# EAGLE schematic FLIC V2 (EAGLE 6.5.0)
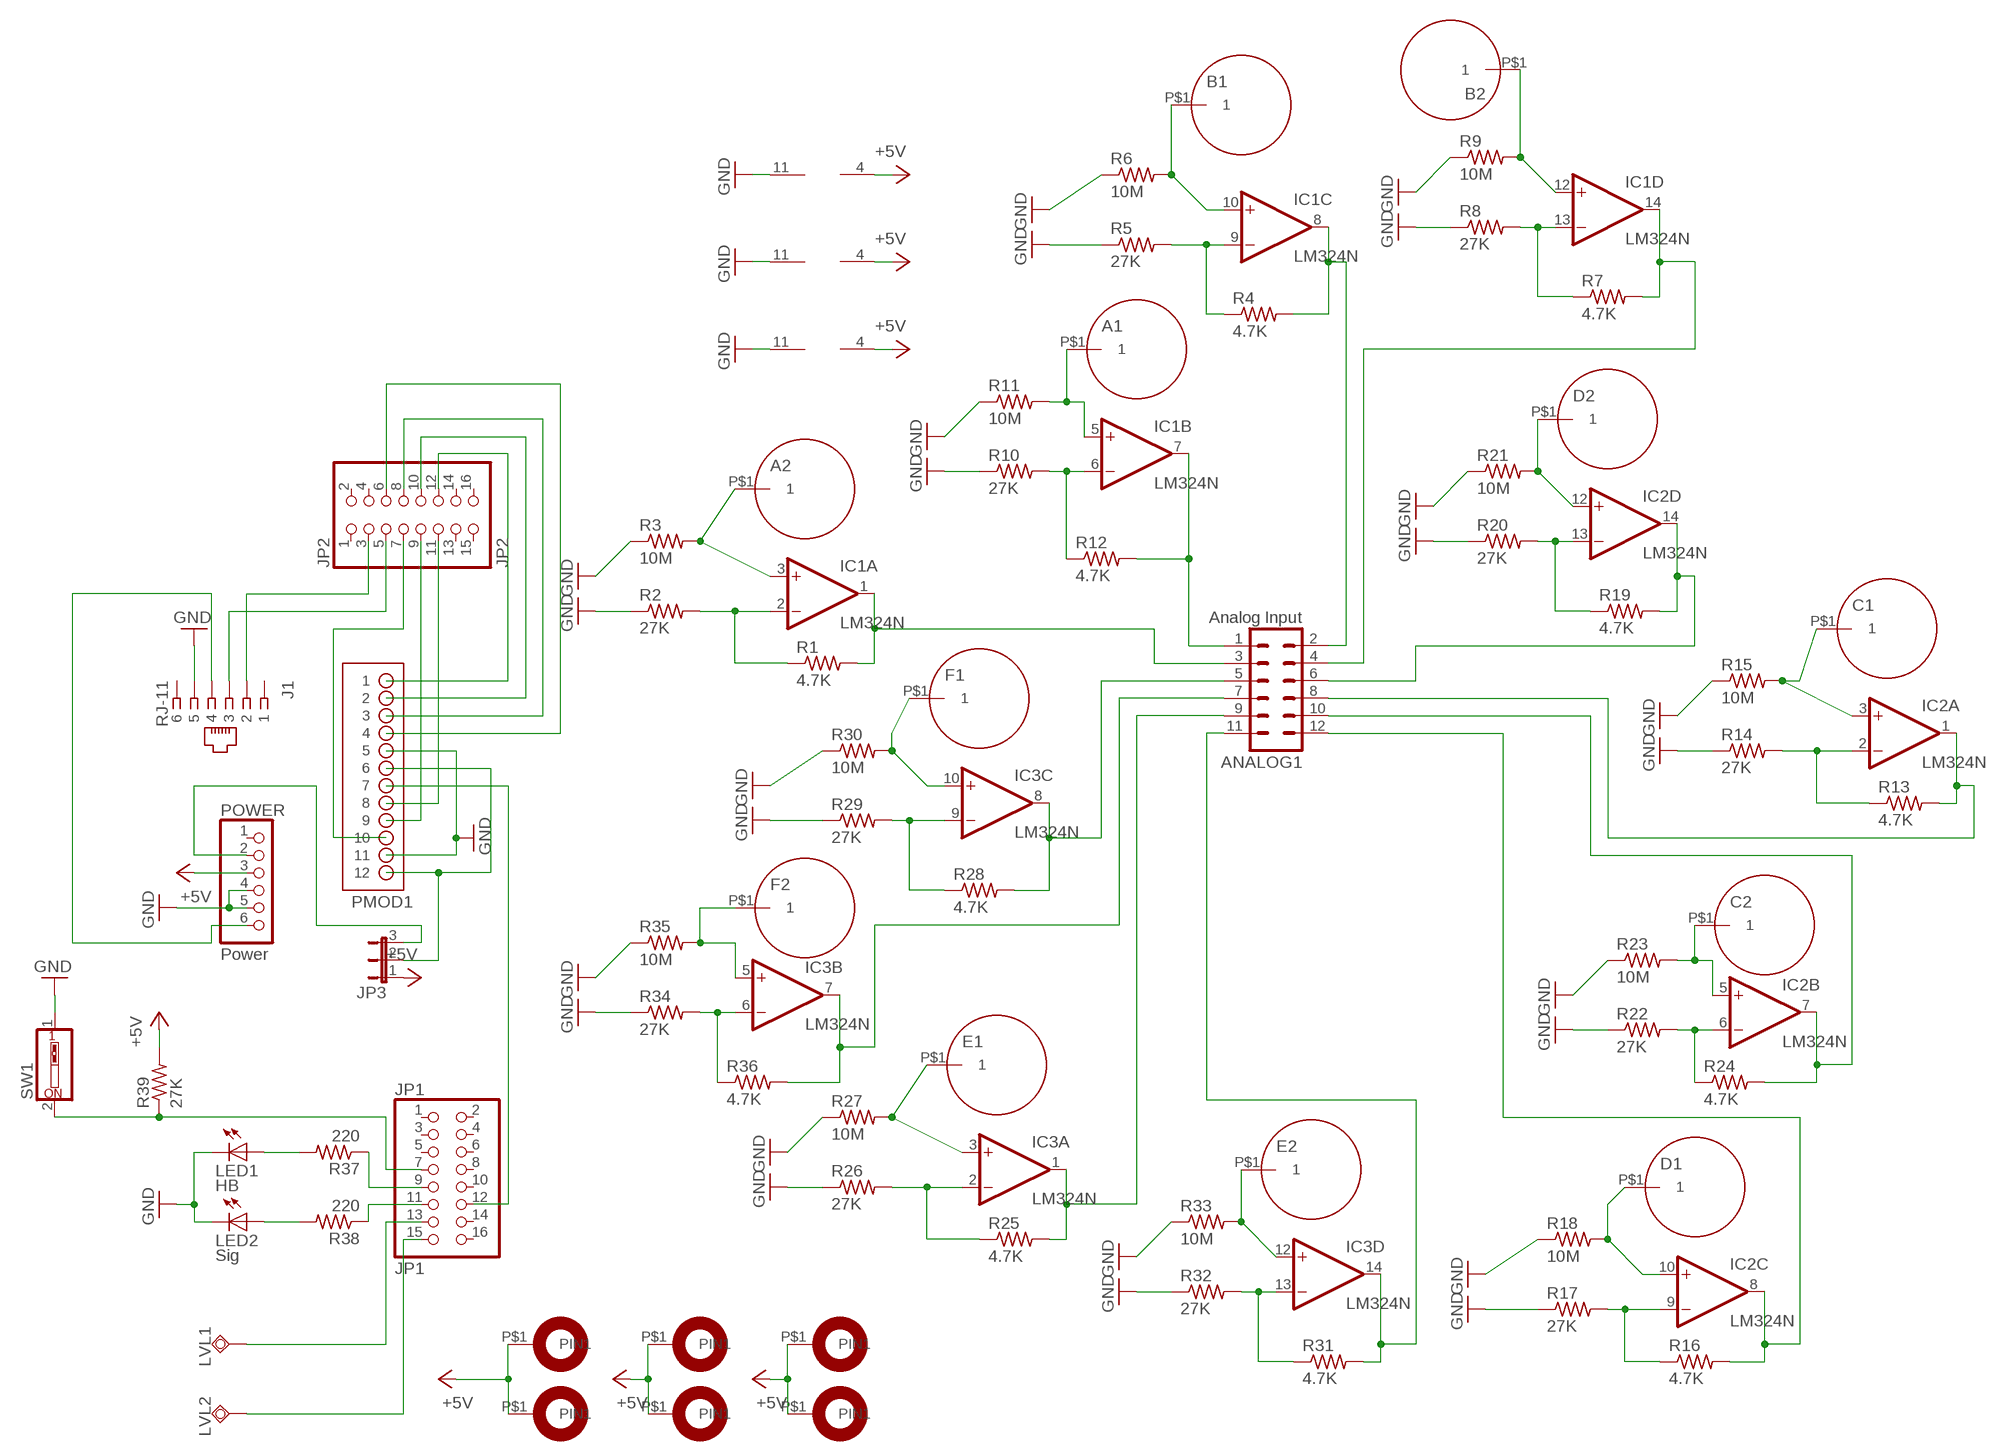
[diagram p0: schematic, sheet 1]

## Parts
A1  FLIC_PADPAD  [FLICPAD]
A2  FLIC_PADPAD  [FLICPAD]
ANALOG1  Analog Input  MA06-2  [MA06-2]
B1  FLIC_PADPAD  [FLICPAD]
B2  FLIC_PADPAD  [FLICPAD]
C1  FLIC_PADPAD  [FLICPAD]
C2  FLIC_PADPAD  [FLICPAD]
D1  FLIC_PADPAD  [FLICPAD]
D2  FLIC_PADPAD  [FLICPAD]
E1  FLIC_PADPAD  [FLICPAD]
E2  FLIC_PADPAD  [FLICPAD]
F1  FLIC_PADPAD  [FLICPAD]
F2  FLIC_PADPAD  [FLICPAD]
IC1  LM324N  [DIL14]
IC2  LM324N  [DIL14]
IC3  LM324N  [DIL14]
J1  RJ-11  RJ11-2L-B  [RJ11-NO_SHIELD]
JP1  JP1  PINHD-2X8  [2X08]
JP2  JP2  PINHD-2X8  [2X08]
JP3  JP2E  [JP2]
LED1  HB  LED3MM  [LED3MM]
LED2  Sig  LED3MM  [LED3MM]
LVL1  TPSQTP20R  [TP20R]
LVL2  TPSQTP20R  [TP20R]
PMOD1  PMOD-2X6-S  [PMOD-2X6-S]
POWER  Power  PINHD-1X6  [1X06]
R1  4.7K  R-US_0207/10  [0207/10]
R2  27K  R-US_0207/10  [0207/10]
R3  10M  R-US_0207/10  [0207/10]
R4  4.7K  R-US_0207/10  [0207/10]
R5  27K  R-US_0207/10  [0207/10]
R6  10M  R-US_0207/10  [0207/10]
R7  4.7K  R-US_0207/10  [0207/10]
R8  27K  R-US_0207/10  [0207/10]
R9  10M  R-US_0207/10  [0207/10]
R10  27K  R-US_0207/10  [0207/10]
R11  10M  R-US_0207/10  [0207/10]
R12  4.7K  R-US_0207/10  [0207/10]
R13  4.7K  R-US_0207/10  [0207/10]
R14  27K  R-US_0207/10  [0207/10]
R15  10M  R-US_0207/10  [0207/10]
R16  4.7K  R-US_0207/10  [0207/10]
R17  27K  R-US_0207/10  [0207/10]
R18  10M  R-US_0207/10  [0207/10]
R19  4.7K  R-US_0207/10  [0207/10]
R20  27K  R-US_0207/10  [0207/10]
R21  10M  R-US_0207/10  [0207/10]
R22  27K  R-US_0207/10  [0207/10]
R23  10M  R-US_0207/10  [0207/10]
R24  4.7K  R-US_0207/10  [0207/10]
R25  4.7K  R-US_0207/10  [0207/10]
R26  27K  R-US_0207/10  [0207/10]
R27  10M  R-US_0207/10  [0207/10]
R28  4.7K  R-US_0207/10  [0207/10]
R29  27K  R-US_0207/10  [0207/10]
R30  10M  R-US_0207/10  [0207/10]
R31  4.7K  R-US_0207/10  [0207/10]
R32  27K  R-US_0207/10  [0207/10]
R33  10M  R-US_0207/10  [0207/10]
R34  27K  R-US_0207/10  [0207/10]
R35  10M  R-US_0207/10  [0207/10]
R36  4.7K  R-US_0207/10  [0207/10]
R37  220  R-US_0207/10  [0207/10]
R38  220  R-US_0207/10  [0207/10]
R39  27K  R-US_0207/10  [0207/10]
SW1  SW_DIP-1  [EDG-01]
U$1  4MM_HOLEA  [4MM]
U$2  4MM_HOLEA  [4MM]
U$3  4MM_HOLEA  [4MM]
U$4  4MM_HOLEA  [4MM]
U$5  4MM_HOLEA  [4MM]
U$6  4MM_HOLEA  [4MM]

## Nets
+5V: IC1.4(P:V+) IC2.4(P:V+) IC3.4(P:V+) JP3.1 POWER.3 R39.2 U$1.P$1(PIN1) U$2.P$1(PIN1) U$3.P$1(PIN1) U$4.P$1(PIN1) U$5.P$1(PIN1) U$6.P$1(PIN1)
GND: IC1.11(P:V-) IC2.11(P:V-) IC3.11(P:V-) J1.5 LED1.K(C) LED2.K(C) PMOD1.5 PMOD1.11 POWER.4 POWER.5 R2.1 R3.1 R5.1 R6.1 R8.1 R9.1 R10.1 R11.1 R14.1 R15.1 R17.1 R18.1 R20.1 R21.1 R22.1 R23.1 R26.1 R27.1 R29.1 R30.1 R32.1 R33.1 R34.1 R35.1 SW1.1
N$1: IC1.2(A:-IN) R1.1 R2.2
N$2: A2.P$1 IC1.3(A:+IN) R3.2
N$3: IC1.13(D:-IN) R7.1 R8.2
N$4: A1.P$1 IC1.5(B:+IN) R11.2
N$5: B1.P$1 IC1.10(C:+IN) R6.2
N$6: IC2.2(A:-IN) R13.1 R14.2
N$7: C1.P$1 IC2.3(A:+IN) R15.2
N$8: B2.P$1 IC1.12(D:+IN) R9.2
N$9: ANALOG1.4 IC1.14(D:OUT) R7.2
N$10: IC1.6(B:-IN) R10.2 R12.1
N$11: JP2.10 PMOD1.2
N$12: D1.P$1 IC2.10(C:+IN) R18.2
N$13: IC1.9(C:-IN) R4.1 R5.2
N$14: ANALOG1.3 IC1.1(A:OUT) R1.2
N$15: ANALOG1.1 IC1.7(B:OUT) R12.2
N$16: D2.P$1 IC2.12(D:+IN) R21.2
N$17: ANALOG1.6 IC2.14(D:OUT) R19.2
N$18: IC2.6(B:-IN) R22.2 R24.1
N$19: IC2.9(C:-IN) R16.1 R17.2
N$20: C2.P$1 IC2.5(B:+IN) R23.2
N$21: IC3.2(A:-IN) R25.1 R26.2
N$22: ANALOG1.12 IC2.8(C:OUT) R16.2
N$23: ANALOG1.10 IC2.7(B:OUT) R24.2
N$24: IC2.13(D:-IN) R19.1 R20.2
N$25: ANALOG1.8 IC2.1(A:OUT) R13.2
N$26: E1.P$1 IC3.3(A:+IN) R27.2
N$27: F1.P$1 IC3.10(C:+IN) R30.2
N$28: E2.P$1 IC3.12(D:+IN) R33.2
N$29: ANALOG1.11 IC3.14(D:OUT) R31.2
N$30: IC3.6(B:-IN) R34.2 R36.1
N$31: IC3.9(C:-IN) R28.1 R29.2
N$32: F2.P$1 IC3.5(B:+IN) R35.2
N$33: ANALOG1.5 IC3.8(C:OUT) R28.2
N$34: ANALOG1.7 IC3.7(B:OUT) R36.2
N$35: IC3.13(D:-IN) R31.1 R32.2
N$36: JP2.8 PMOD1.3
N$37: LED1.A R37.2
N$38: LED2.A R38.2
N$39: JP1.9 R37.1
N$40: JP1.11 R38.1
N$41: JP1.13 LVL1.TP
N$42: JP1.15 LVL2.TP
N$43: J1.2 JP2.3
N$44: J1.3 JP2.5
N$45: J1.4 POWER.6
N$46: ANALOG1.9 IC3.1(A:OUT) R25.2
N$47: JP2.6 PMOD1.4
N$48: ANALOG1.2 IC1.8(C:OUT) R4.2
N$49: JP1.12 PMOD1.7
N$50: JP2.11 PMOD1.8
N$51: JP2.9 PMOD1.9
N$52: JP2.12 PMOD1.1
N$53: JP2.7 PMOD1.10
N$54: JP3.2 PMOD1.6 PMOD1.12
N$55: JP3.3 POWER.2
N$56: JP1.7 R39.1 SW1.2
Unconnected: J1.1 J1.6 JP1.1 JP1.2 JP1.3 JP1.4 JP1.5 JP1.6 JP1.8 JP1.10 JP1.14 JP1.16 JP2.1 JP2.2 JP2.4 JP2.13 JP2.14 JP2.15 JP2.16 POWER.1

## Library data of the parts
A1 A2 B1 B2 C1 C2 D1 D2 E1 E2 F1 F2 = SDP:FLIC_PAD: A standard signal pad for FLIC 1.0 and 2.0.
ANALOG1 = con-lstb:MA06-2: PIN HEADER; OC_FARNELL: unknown; OC_NEWARK: unknown
IC1-IC3 = linear:LM324: OP AMP
J1 = con-tycoelectronics:RJ11: CORCOM Modular RJ Jacks No Shield Source: www.tycoelectronics.com .. ENG_DS_1654001_1099_RJ_L_0507.pdf; MF: TYCO ELECTRONICS; MPN: RJ11-2L-B; OC_FARNELL: unknown; OC_NEWARK: 83F4463
JP1 JP2 = pinhead:PINHD-2X8: PIN HEADER
JP3 = jumper:JP2E: JUMPER
LED1 LED2 = adafruit:LED: LED OSRAM: - CHIPLED LG R971, LG N971, LY N971, LG Q971, LY Q971, LO R971, LY R971 LH N974, LH R974 LS Q976, LO Q976, LY Q976 LO Q996 - Hyper CHIPLED LW Q18S LB Q993, LB Q99A, LB R99A - SideLED LS A670, LO A670, LY A670, LG A670, LP A670 LB A673, LV A673, LT A673, LW A673 LH A674 LY A675 LS A676, LA A676, LO A676, LY A676, LW A676 LS A679, LY A679, LG A679 - Hyper Micro SIDELED® LS Y876, LA Y876, LO Y876, LY Y876 LT Y87S - SmartLED LW L88C, LW L88S LB L89C, LB L89S, LG L890 LS L89K, LO L89K, LY L89K LS L896, LA L896, LO L896, LY L896 - TOPLED LS T670, LO T670, LY T670, LG T670, LP T670 LSG T670, LSP T670, LSY T670, LOP T670, LYG T670 LG T671, LOG T671, LSG T671 LB T673, LV T673, LT T673, LW T673 LH T674 LS T676, LA T676, LO T676, LY T676, LB T676, LH T676, LSB T676, LW T676 LB T67C, LV T67C, LT T67C, LS T67K, LO T67K, LY T67K, LW E67C LS E67B, LA E67B, LO E67B, LY E67B, LB E67C, LV E67C, LT E67C LW T67C LS T679, LY T679, LG T679 LS T770, LO T770, LY T770, LG T770, LP T770 LB T773, LV T773, LT T773, LW T773 LH T774 LS E675, LA E675, LY E675, LS T675 LS T776, LA T776, LO T776, LY T776, LB T776 LHGB T686 LT T68C, LB T68C - Hyper Mini TOPLED® LB M676 - Mini TOPLED Santana® LG M470 LS M47K, LO M47K, LY M47K Source: http://www.osram.convergy.de/
LVL1 LVL2 = testpad:TPSQ: Test pad
PMOD1 = chipKIT MX3:PMOD-2X6-S: PMOD 2x6 System board (female) connector
POWER = pinhead:PINHD-1X6: PIN HEADER
R1-R39 = resistor:R-US_: RESISTOR, American symbol
SW1 = special:SW_DIP-1: DIP SWITCH
U$1-U$6 = SDP:4MM_HOLE

## Net classes
0 default: width 0.61 mm